# EAGLE schematic LED_Schaltung (EAGLE 9.6.0)
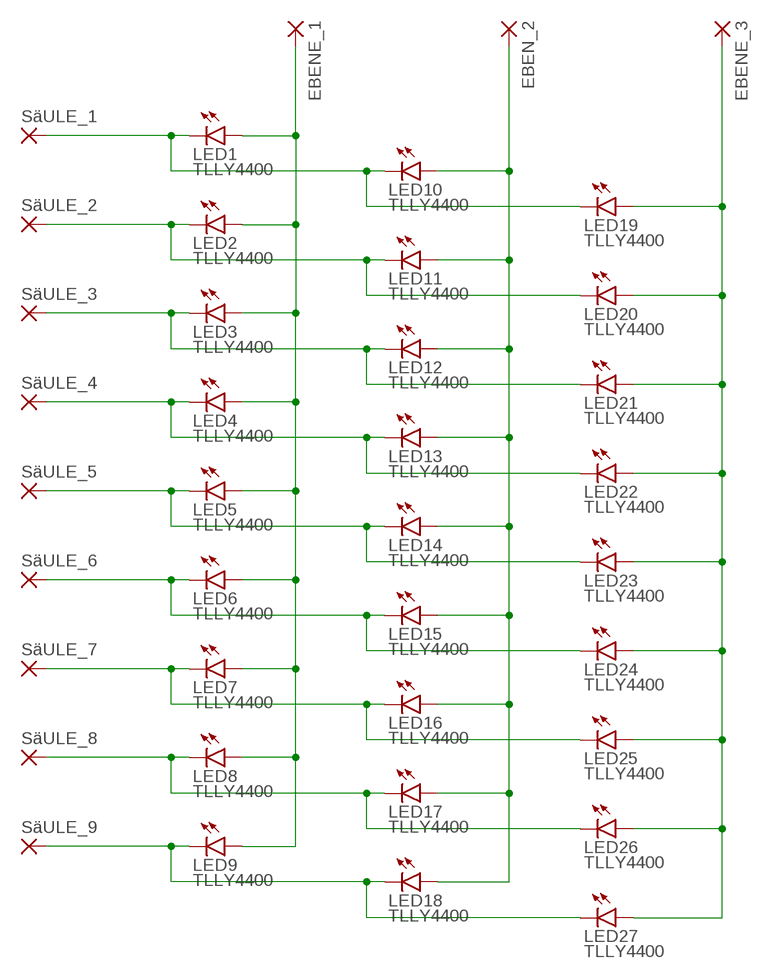
[diagram p0: schematic, sheet 1]

## Parts
EBEN_2  2,54/1,0  [2,54/1,0]
EBENE_1  2,54/1,0  [2,54/1,0]
EBENE_3  2,54/1,0  [2,54/1,0]
LED1  TLLY4400  [LED3MM]
LED2  TLLY4400  [LED3MM]
LED3  TLLY4400  [LED3MM]
LED4  TLLY4400  [LED3MM]
LED5  TLLY4400  [LED3MM]
LED6  TLLY4400  [LED3MM]
LED7  TLLY4400  [LED3MM]
LED8  TLLY4400  [LED3MM]
LED9  TLLY4400  [LED3MM]
LED10  TLLY4400  [LED3MM]
LED11  TLLY4400  [LED3MM]
LED12  TLLY4400  [LED3MM]
LED13  TLLY4400  [LED3MM]
LED14  TLLY4400  [LED3MM]
LED15  TLLY4400  [LED3MM]
LED16  TLLY4400  [LED3MM]
LED17  TLLY4400  [LED3MM]
LED18  TLLY4400  [LED3MM]
LED19  TLLY4400  [LED3MM]
LED20  TLLY4400  [LED3MM]
LED21  TLLY4400  [LED3MM]
LED22  TLLY4400  [LED3MM]
LED23  TLLY4400  [LED3MM]
LED24  TLLY4400  [LED3MM]
LED25  TLLY4400  [LED3MM]
LED26  TLLY4400  [LED3MM]
LED27  TLLY4400  [LED3MM]
SäULE_1  2,54/1,0  [2,54/1,0]
SäULE_2  2,54/1,0  [2,54/1,0]
SäULE_3  2,54/1,0  [2,54/1,0]
SäULE_4  2,54/1,0  [2,54/1,0]
SäULE_5  2,54/1,0  [2,54/1,0]
SäULE_6  2,54/1,0  [2,54/1,0]
SäULE_7  2,54/1,0  [2,54/1,0]
SäULE_8  2,54/1,0  [2,54/1,0]
SäULE_9  2,54/1,0  [2,54/1,0]

## Nets
N$1: LED1.K(C) LED10.K(C) LED19.K(C) SäULE_1.1(P)
N$2: LED2.K(C) LED11.K(C) LED20.K(C) SäULE_2.1(P)
N$3: LED3.K(C) LED12.K(C) LED21.K(C) SäULE_3.1(P)
N$4: LED4.K(C) LED13.K(C) LED22.K(C) SäULE_4.1(P)
N$5: LED5.K(C) LED14.K(C) LED23.K(C) SäULE_5.1(P)
N$6: LED6.K(C) LED15.K(C) LED24.K(C) SäULE_6.1(P)
N$7: LED7.K(C) LED16.K(C) LED25.K(C) SäULE_7.1(P)
N$8: LED8.K(C) LED17.K(C) LED26.K(C) SäULE_8.1(P)
N$9: LED9.K(C) LED18.K(C) LED27.K(C) SäULE_9.1(P)
N$10: EBENE_1.1(P) LED1.A LED2.A LED3.A LED4.A LED5.A LED6.A LED7.A LED8.A LED9.A
N$11: EBENE_3.1(P) LED19.A LED20.A LED21.A LED22.A LED23.A LED24.A LED25.A LED26.A LED27.A
N$17: EBEN_2.1(P) LED10.A LED11.A LED12.A LED13.A LED14.A LED15.A LED16.A LED17.A LED18.A

## Library data of the parts
EBEN_2 EBENE_1 EBENE_3 SäULE_1-SäULE_9 = wirepad:2,54/1,0: THROUGH-HOLE PAD
LED1-LED27 = led:TLLY4400: Low Current (2mA) LED 3 mm Tinted Diffused Package color YELLOW Source: Data sheet <http://www.farnell.com/datasheets/391098.pdf>; MF: VISHAY SEMICONDUCTOR; OC_FARNELL: 1612439